# Altium project Clock_7Seg.PrjPcb
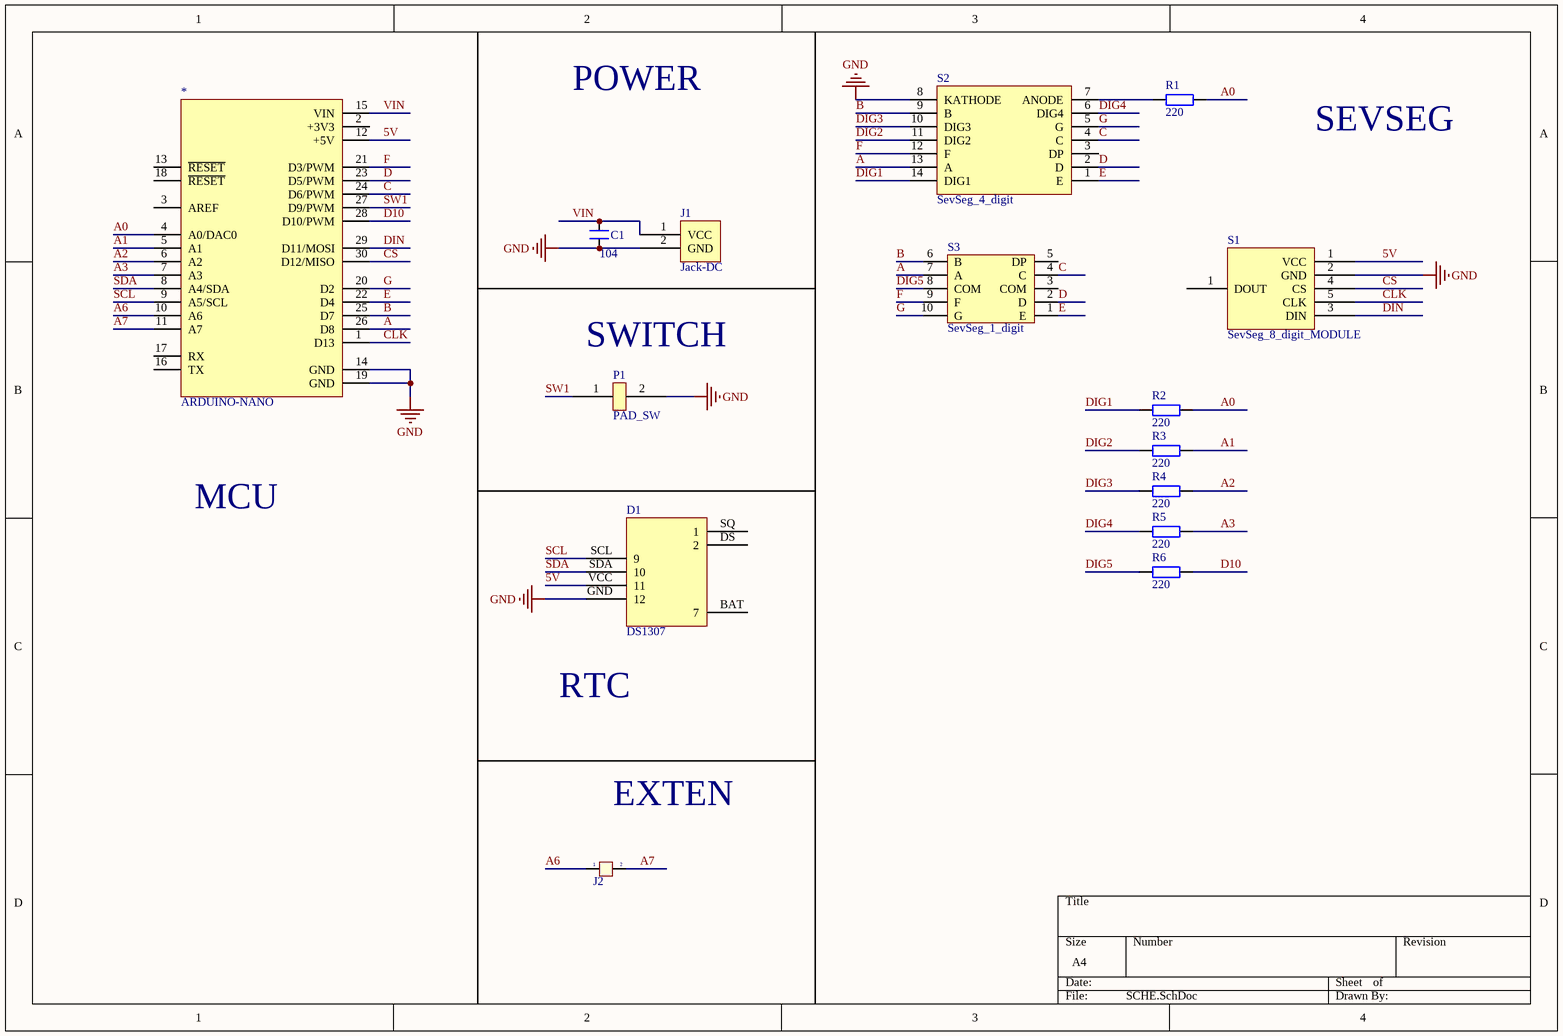
[diagram p0: SCHE.SchDoc]
1 sheet, 15 parts. Net scope: global (net labels, ports and power ports of the same name join across sheets).
Board file: pcb.PcbDoc

## Sheet SCHE.SchDoc
size A4; SheetNumber: 1; SheetTotal: 1

### Parts
*  ARDUINO-NANO  [ARDUINO-NANO]
C1  104  [CN2]
D1  DS1307  [DS1307-MODULE]
J1  Jack-DC  [Jack-DC]
J2  Jumper 2  [jp2h]  (value not drawn)
P1  PAD_SW  [PAD_SW]
R1  220  [R1/4W]
R2  220  [R1/4W]
R3  220  [R1/4W]
R4  220  [R1/4W]
R5  220  [R1/4W]
R6  220  [R1/4W]
S1  SevSeg_8_digit_MODULE  [SevSeg_8_digit_MODULE]
S2  SevSeg_4_digit  [SevSeg_4_digit]
S3  SevSeg_1_digit  [SevSeg_1_digit]

### Nets
GND: *.14(GND) *.19(GND) C1.1 D1.GND(12) J1.2(GND) P1.2(SW2) S1.2(GND) S2.8(KATHODE)
5V: *.12(+5V) D1.VCC(11) S1.1(VCC)
A: *.26(D8) S2.13(A) S3.7(A)
A0: *.4(A0/DAC0) R1.2 R2.2
A1: *.5(A1) R3.2
A2: *.6(A2) R4.2
A3: *.7(A3) R5.2
A6: *.10(A6) J2.1
A7: *.11(A7) J2.2
B: *.25(D7) S2.9(B) S3.6(B)
C: *.24(D6/PWM) S2.4(C) S3.4(C)
CLK: *.1(D13) S1.5(CLK)
CS: *.30(D12/MISO) S1.4(CS)
D: *.23(D5/PWM) S2.2(D) S3.2(D)
D10: *.28(D10/PWM) R6.2
DIG1: R2.1 S2.14(DIG1)
DIG2: R3.1 S2.11(DIG2)
DIG3: R4.1 S2.10(DIG3)
DIG4: R5.1 S2.6(DIG4)
DIG5: R6.1 S3.8(COM)
DIN: *.29(D11/MOSI) S1.3(DIN)
E: *.22(D4) S2.1(E) S3.1(E)
F: *.21(D3/PWM) S2.12(F) S3.9(F)
G: *.20(D2) S2.5(G) S3.10(G)
SCL: *.9(A5/SCL) D1.SCL(9)
SDA: *.8(A4/SDA) D1.SDA(10)
SW1: *.27(D9/PWM) P1.1(SW1)
VIN: *.15(VIN) C1.2 J1.1(VCC)
NetR1_1: R1.1 S2.7(ANODE)

Not connected (* = marked no-connect by the designer): * 2(+3V3) 3(AREF) 13(~{RESET}) 16(TX) 17(RX) 18(~{RESET}); D1 BAT(7) DS(2) SQ(1); S2 3(DP); S3 3(COM) 5(DP)

### Notes on the sheet
- POWER
- SEVSEG
- (near P1) SWITCH
- MCU
- RTC
- EXTEN

### Library data of the parts
C1 = CN2: Cap np 104 => 105pF; Value: 0.1uF
D1 = DS1307_MODULE
J2 = JP 2: Value: JP 2
R1-R6 = R1/4W: Resistor 1/4W; Value: R1/4W - 1K
S1 = SevSeg_8_digit_MODULE: common kathode, MAX7219
S2 = SevSeg_4_digit: common anode
S3 = SevSeg_1_digit: common anode